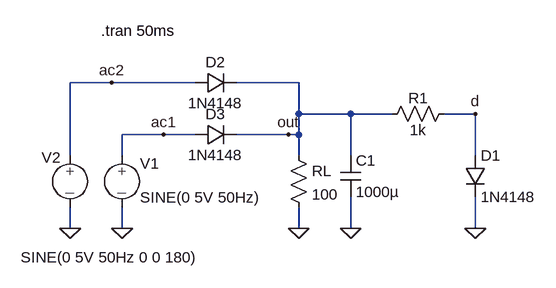
[diagram p0: schematic gleichrichter.asc]
gleichrichter.asc, the LTspice schematic file:
Version 4
SHEET 1 880 680
WIRE 0 32 -64 32
WIRE 128 32 0 32
WIRE 288 32 192 32
WIRE 288 80 288 32
WIRE 368 80 288 80
WIRE 432 80 368 80
WIRE 560 80 512 80
WIRE 80 112 16 112
WIRE 128 112 80 112
WIRE 272 112 192 112
WIRE 288 112 288 80
WIRE 288 112 272 112
WIRE -64 144 -64 32
WIRE 16 144 16 112
WIRE 288 144 288 112
WIRE 368 144 368 80
WIRE 560 144 560 80
WIRE -64 256 -64 224
WIRE 16 256 16 224
WIRE 288 256 288 224
WIRE 368 256 368 208
WIRE 560 256 560 208
FLAG 288 256 0
FLAG 16 256 0
FLAG 272 112 out
FLAG -64 256 0
FLAG 80 112 ac1
FLAG 0 32 ac2
FLAG 368 256 0
FLAG 560 256 0
FLAG 560 80 d
SYMBOL source-V 16 128 R0
WINDOW 123 0 0 Left 2
WINDOW 39 0 0 Left 2
SYMATTR InstName V1
SYMATTR Value SINE(0 5V 50Hz)
SYMBOL diode 128 128 R270
WINDOW 0 32 32 VTop 2
WINDOW 3 0 32 VBottom 2
SYMATTR InstName D3
SYMATTR Value 1N4148
SYMBOL res 272 128 R0
SYMATTR InstName RL
SYMATTR Value 100
SYMBOL diode 128 48 R270
WINDOW 0 32 32 VTop 2
WINDOW 3 0 32 VBottom 2
SYMATTR InstName D2
SYMATTR Value 1N4148
SYMBOL source-V -64 128 R0
WINDOW 123 0 0 Left 2
WINDOW 39 0 0 Left 2
WINDOW 0 -44 19 Left 2
WINDOW 3 -76 173 Left 2
SYMATTR InstName V2
SYMATTR Value SINE(0 5V 50Hz 0 0 180)
SYMBOL cap 352 144 R0
SYMATTR InstName C1
SYMATTR Value 1000µ
SYMBOL diode 544 144 R0
SYMATTR InstName D1
SYMATTR Value 1N4148
SYMBOL res 416 96 R270
WINDOW 0 25 56 VTop 2
WINDOW 3 7 56 VBottom 2
SYMATTR InstName R1
SYMATTR Value 1k
TEXT -16 -48 Left 2 !.tran 50ms

The netlist it stands for:
* gleichrichter.asc
V1 ac1 0 SINE(0 5V 50Hz)
D3 ac1 out 1N4148
RL out 0 100
D2 ac2 out 1N4148
V2 ac2 0 SINE(0 5V 50Hz 0 0 180)
C1 out 0 1000µ
D1 d 0 1N4148
R1 out d 1k
.model D D
.lib standard.dio
.tran 50ms
.backanno
.end